# EAGLE design H0FR60 (EAGLE 9.3.0)

## Sheet 1 of 2
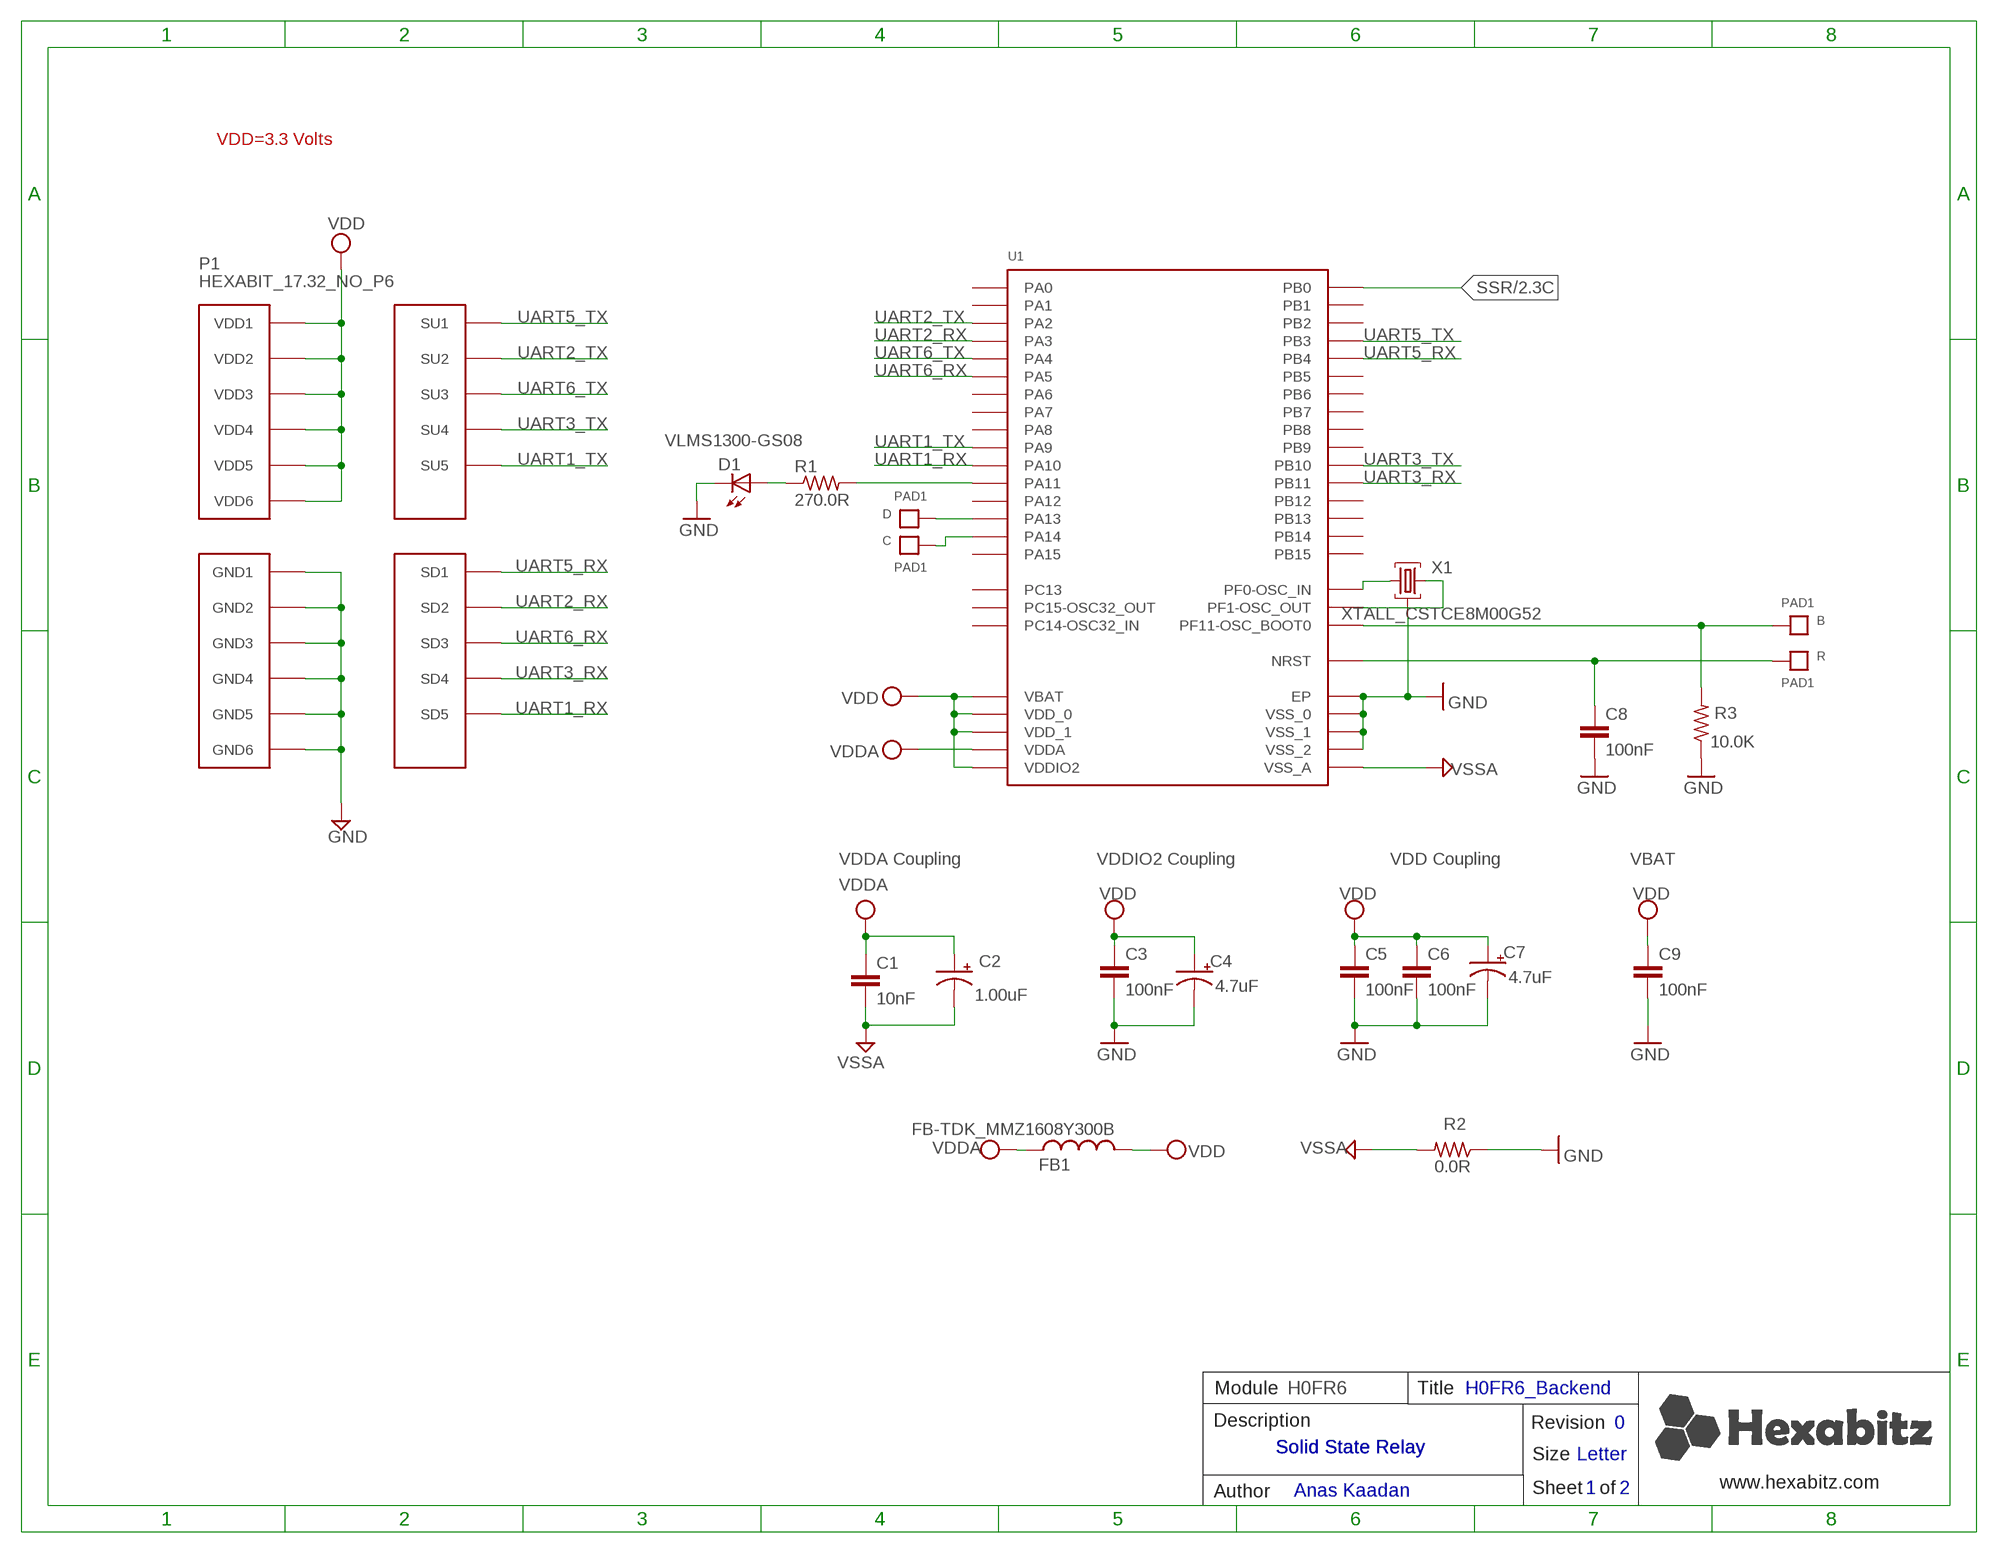
[diagram p0: schematic, sheet 1]

### Parts
B  PAD1  [PAD1]
C  PAD1  [PAD1]
C1  10nF  C-0603  [C-0603]
C2  1.00uF  C-0805-POL  [C-0805-POL]
C3  100nF  C-0603  [C-0603]
C4  4.7uF  C-0805-POL  [C-0805-POL]
C5  100nF  C-0603  [C-0603]
C6  100nF  C-0603  [C-0603]
C7  4.7uF  C-0805-POL  [C-0805-POL]
C8  100nF  C-0603  [C-0603]
C9  100nF  C-0603  [C-0603]
D  PAD1  [PAD1]
D1  VLMS1300-GS08  [VLMS1300-GS08]
FB1  FB-TDK_MMZ1608Y300B  [FB-TDK_MMZ1608Y300B]
P1  HEXABIT_17.32_NO_P6  [HEXABIT_17.32_NO_P6]
R  PAD1  [PAD1]
R1  270.0R  R-0603  [R-0603]
R2  0.0R  R-0603  [R-0603]
R3  10.0K  R-0603  [R-0603]
U1  STM32F091CBU6  [STM32F091CBU6]
X1  XTALL_CSTCE8M00G52  [XTALL_CSTCE8M00G52]

### Nets
B1: B.P$1 B.P$2 R3.2 U1.P$44(PF11-OSC_BOOT0)
GND: C3.2 C4.2(-) C5.2 C6.2 C7.2(-) C8.2 C9.2 D1.C P1.PAD_PD7(GND1) P1.PAD_PD8(GND2) P1.PAD_PD9(GND3) P1.PAD_PD10(GND4) P1.PAD_PD11(GND5) P1.PAD_PD12(GND6) R2.1 R3.1 U1.EP U1.P$23(VSS_0) U1.P$35(VSS_1) U1.P$47(VSS_2) X1.P$2 ; also sheet 2
N$1: D.P$1 D.P$2 U1.P$34(PA13)
N$2: C.P$1 C.P$2 U1.P$37(PA14)
N$3: R1.2 U1.P$32(PA11)
N$4: D1.A R1.1
N$5: U1.P$5(PF0-OSC_IN) X1.P$1
N$6: U1.P$6(PF1-OSC_OUT) X1.P$3
R1: C8.1 R.P$1 R.P$2 U1.P$7(NRST)
SSR: U1.P$18(PB0) ; also sheet 2
UART1_RX: P1.PAD_PD5(SD5) U1.P$31(PA10)
UART1_TX: P1.PAD_PU5(SU5) U1.P$30(PA9)
UART2_RX: P1.PAD_PD2(SD2) U1.P$13(PA3)
UART2_TX: P1.PAD_PU2(SU2) U1.P$12(PA2)
UART3_RX: P1.PAD_PD4(SD4) U1.P$22(PB11)
UART3_TX: P1.PAD_PU4(SU4) U1.P$21(PB10)
UART5_RX: P1.PAD_PD1(SD1) U1.P$40(PB4)
UART5_TX: P1.PAD_PU1(SU1) U1.P$39(PB3)
UART6_RX: P1.PAD_PD3(SD3) U1.P$15(PA5)
UART6_TX: P1.PAD_PU3(SU3) U1.P$14(PA4)
VDD: C3.1 C4.1(+) C5.1 C6.1 C7.1(+) C9.1 FB1.2 P1.PAD_PU7(VDD1) P1.PAD_PU8(VDD2) P1.PAD_PU9(VDD3) P1.PAD_PU10(VDD4) P1.PAD_PU11(VDD5) P1.PAD_PU12(VDD6) U1.P$1(VBAT) U1.P$24(VDD_0) U1.P$36(VDDIO2) U1.P$48(VDD_1) ; also sheet 2
VDDA: C1.1 C2.1(+) FB1.1 U1.P$9(VDDA)
VSSA: C1.2 C2.2(-) R2.2 U1.P$8(VSS_A)
Unconnected: U1.P$2(PC13) U1.P$3(PC14-OSC32_IN) U1.P$4(PC15-OSC32_OUT) U1.P$10(PA0) U1.P$11(PA1) U1.P$16(PA6) U1.P$17(PA7) U1.P$19(PB1) U1.P$20(PB2) U1.P$25(PB12) U1.P$26(PB13) U1.P$27(PB14) U1.P$28(PB15) U1.P$29(PA8) U1.P$33(PA12) U1.P$38(PA15) U1.P$41(PB5) U1.P$42(PB6) U1.P$43(PB7) U1.P$45(PB8) U1.P$46(PB9)

### Notes on the sheet
- VDD=3.3 Volts
- VDDA Coupling | VDDIO2 Coupling | VDD Coupling | VBAT
- Module | H0FR6 | Title | H0FR6_Backend
- Description | Revision | 0
- Solid State Relay | Solid State Relay
- Size | Letter
- www.hexabitz.com
- Author | Anas Kaadan | Sheet   of | 1 | 2
- C:/Users/Admin/Desktop/logodraft.bmp

## Sheet 2 of 2
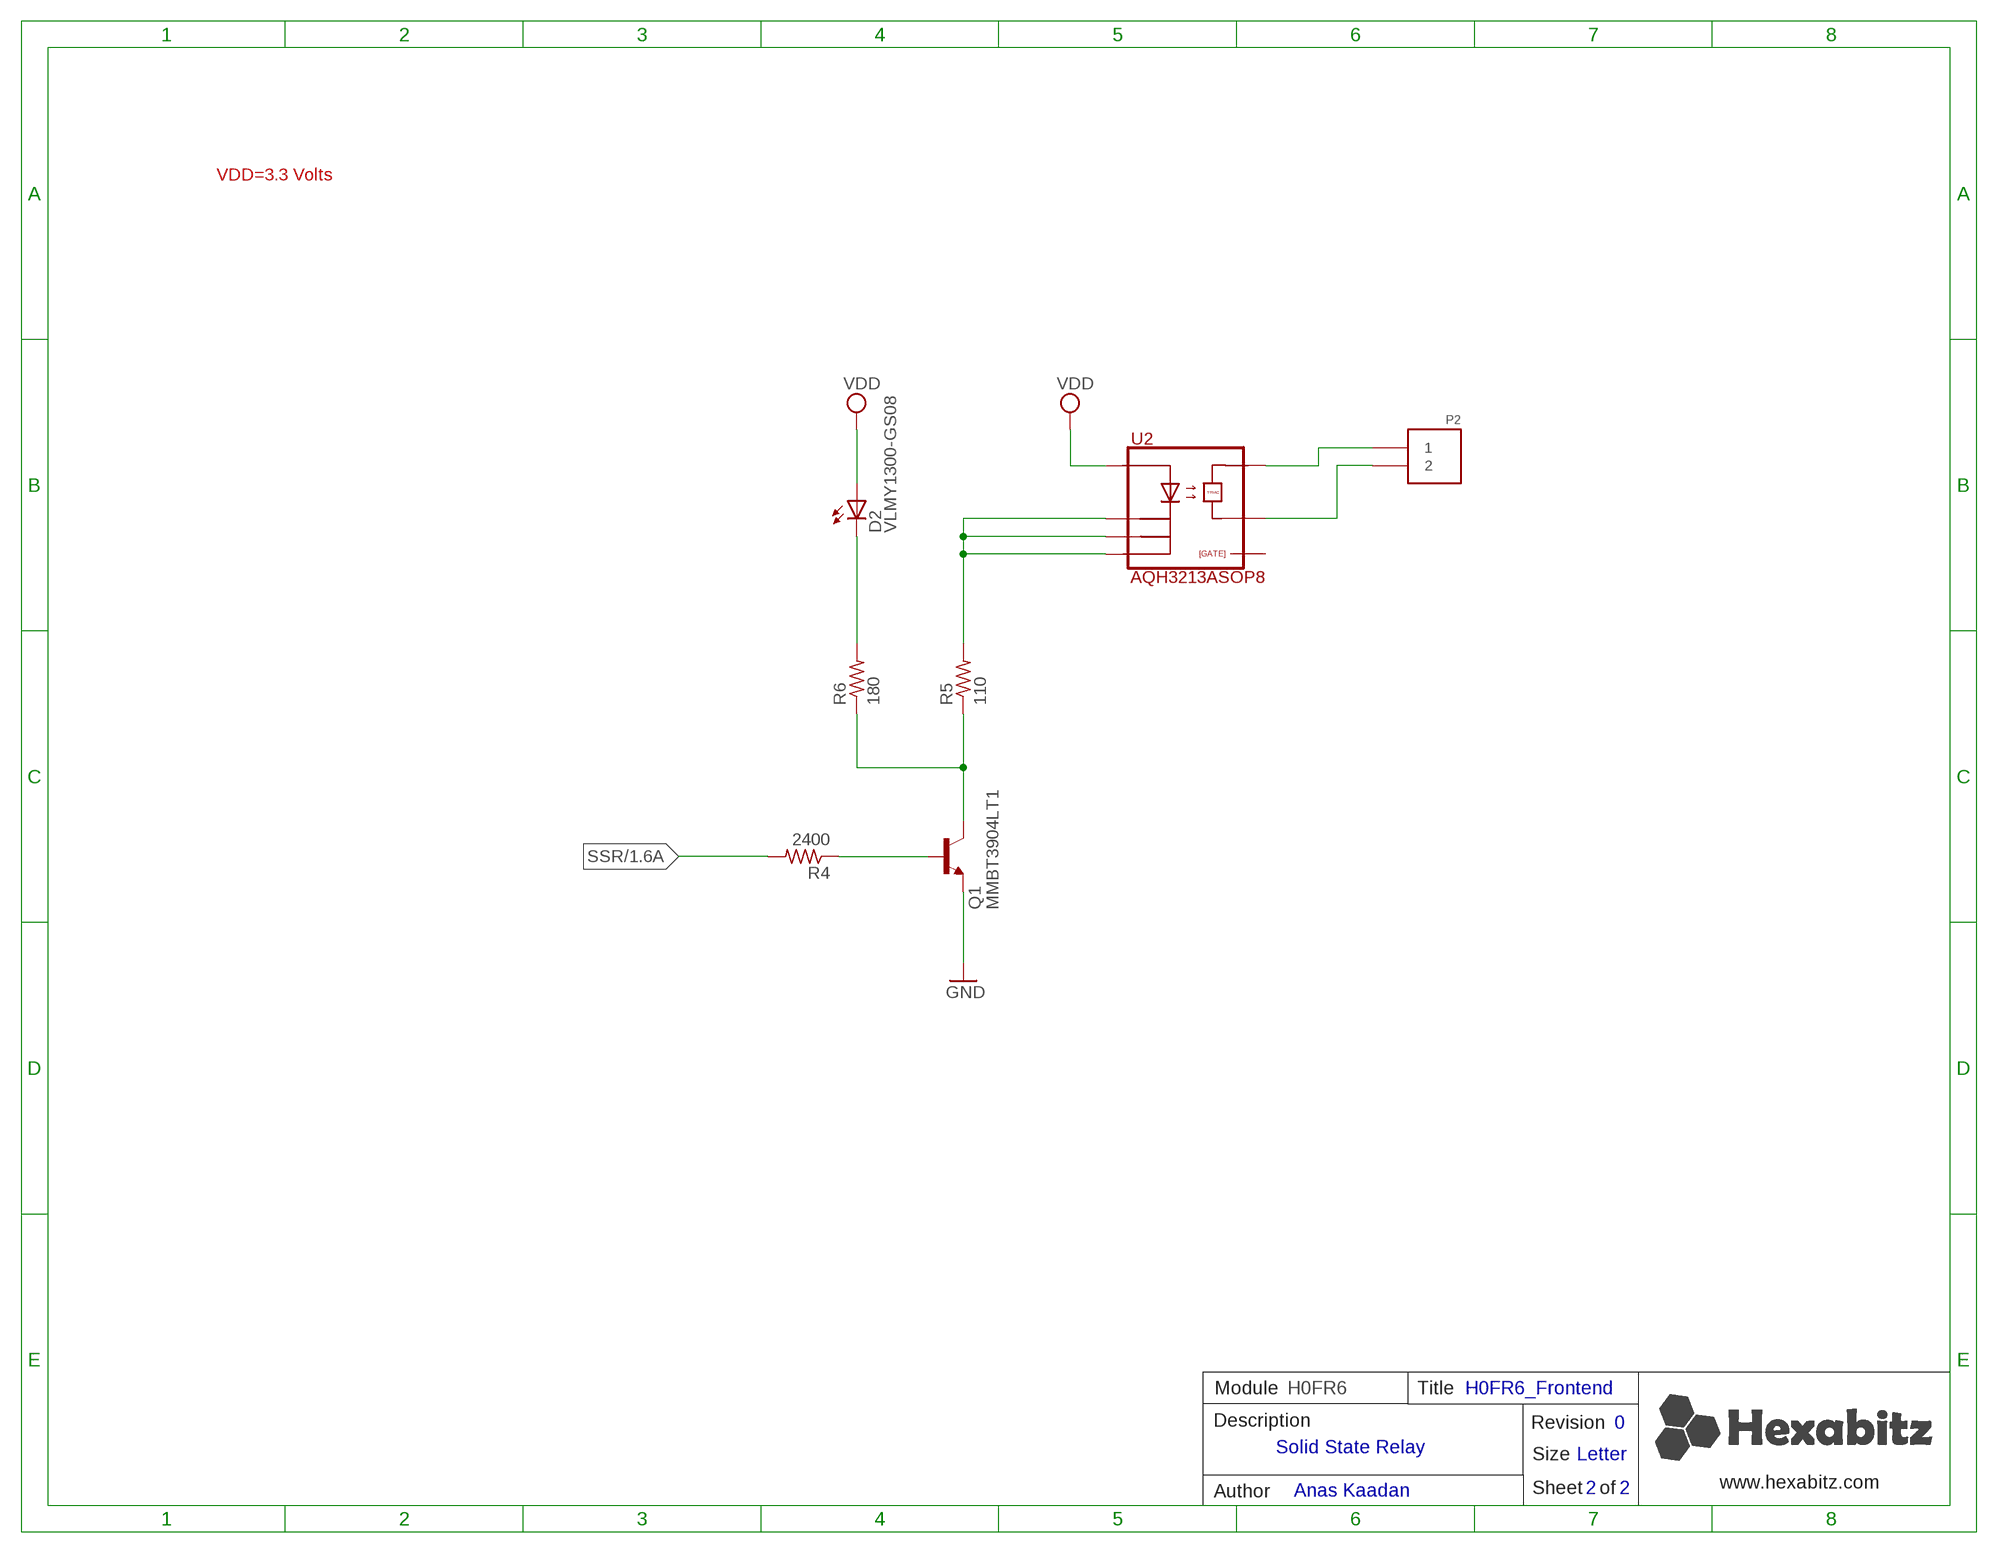
[diagram p1: schematic, sheet 2]

### Parts
D2  VLMY1300-GS08  VLMS1300-GS08  [VLMS1300-GS08]
P2  1546111-2  [1546111-2]
Q1  MMBT3904LT1  [MMBT3904LT1]
R4  2400  R-0603  [R-0603]
R5  110  R-0603  [R-0603]
R6  180  R-0603  [R-0603]
U2  AQH3213ASOP8  [AQH3213A]

### Nets
GND: Q1.2(E) ; also sheet 1
N$7: P2.1 U2.P$8
N$8: P2.2 U2.P$6
N$9: D2.C R6.2
N$10: R5.2 U2.P$1 U2.P$3 U2.P$4
N$11: Q1.3(C) R5.1 R6.1
N$13: Q1.1(B) R4.1
SSR: R4.2 ; also sheet 1
VDD: D2.A U2.P$2 ; also sheet 1
Unconnected: U2.P$5

### Notes on the sheet
- VDD=3.3 Volts
- Module | H0FR6 | Title | H0FR6_Frontend
- Description | Revision | 0
- Solid State Relay
- Size | Letter
- www.hexabitz.com
- Author | Anas Kaadan | Sheet   of | 2 | 2

## Library data of the parts
B C D R = Hexabitz:PAD1
C1 = Hexabitz:C-0603: CAP CER 10% X7R 0603; CAPACITANCE: 10nF; MFN: KEMET; MPN: C0603C103K5RACTU; OCTOPART_URL: https://octopart.com/c0603c103k5ractu-kemet-133094?r=sp&s=R_iPBxLnSmGqhkU2rIMFpg; TOLERANCE: 10%; VOLTAGE_RATING: 50V
C2 = Hexabitz:C-0805-POL: Cap Tant Solid SMD 2012; CAPACITANCE: 1.00uF; MFN: Yageo; MPN: CC0805KKX7R7BB105; OCTOPART_URL: https://octopart.com/cc0805kkx7r7bb105-yageo-8376555?r=sp&s=YKl1wwtkROau_X5nniH2ig; TOLERANCE: 10%; VOLTAGE_RATING: 16V
C3 C6 C8 = Hexabitz:C-0603: CAP CER 10% X7R 0603; CAPACITANCE: 100nF; MFN: KEMET; MPN: C0603C104K8RACTU; OCTOPART_URL: https://octopart.com/c0603c104k8ractu-kemet-145075?r=sp&s=9bS9ASSwSEqMCE9KBEQZ0g; TOLERANCE: 10%; VOLTAGE_RATING: 10V
C4 C7 = Hexabitz:C-0805-POL: Cap Tant Solid SMD 2012; CAPACITANCE: 4.7uF; MFN: Murata; MPN: GRM21BC81E475KA12L; OCTOPART_URL: https://octopart.com/grm21bc81e475ka12l-murata-10331911?r=sp&s=RY3qZSD8T6mG6TC9CHI5qQ; TOLERANCE: 10%; VOLTAGE_RATING: 25V
C5 = Hexabitz:C-0603: CAP CER 10% X7R 0603; CAPACITANCE: 100nF; MFN: KEMET; MPN: C0603C104K8RACTU; OCTOPART_URL: https://octopart.com/c0603c104k8ractu-kemet-145075?r=sp&s=9bS9ASSwSEqMCE9KBEQZ0g; TOLERANCE: 10%; VOLTAGE_RATING: 10
C9 = Hexabitz:C-0603: CAP CER 10% X7R 0603; CAPACITANCE: 100nF; MFN: KEMET; MPN: C0603C104K8RACTU; OCTOPART_URL: https://octopart.com/c0603c104k8ractu-kemet-145075?r=sp&s=9bS9ASSwSEqMCE9KBEQZ0g; TOLERANCE: 10V; VOLTAGE_RATING: 10%
D1 = Hexabitz:VLMS1300-GS08: Red 0603 130° Clear 54 mcd 2 V Surface Mount ChipLED ; Octopart Url : http://octopart.com/vlms1300-gs08-vishay-21709201; MFN: Vishay; MPN: VLMS1300-GS08; OCTOPART_URL: https://octopart.com/vlms1300-gs08-vishay-21709201?r=sp&s=_gcP4_q8T1SC6PJQPTQ9yA
D2 = Hexabitz:VLMS1300-GS08: Red 0603 130° Clear 54 mcd 2 V Surface Mount ChipLED ; Octopart Url : http://octopart.com/vlms1300-gs08-vishay-21709201; MFN: Vishay; MPN: VLMY1300-GS08; OCTOPART_URL: https://octopart.com/vlmy1300-gs08-vishay-21709204
FB1 = Hexabitz:FB-TDK_MMZ1608Y300B: Ferrite Beads Multi-Layer 30Ohm 25% 100MHz 1.5A 50mOhm DCR 0603; MFN: TDK; MPN: MMZ1608Y300B; OCTOPART_URL: https://octopart.com/mmz1608y300b-tdk-368280?r=sp&s=cd9_2ZEqQ9q9UNBuQgHAiA
P1 = hexabitz_connectors:HEXABIT_?_NO_P6: Hexabitz Hexagon Module Connector Hexagon side length = 17.32mm. The following ports are removed: P6
P2 = Hexabitz:1546111-2: EUROSTYLE TB,HEADER,GREY,2 POS; MFN: TE Connectivity; MPN: 1546111-2; OCTOPART_URL: https://octopart.com/1546111-2-te+connectivity-40393355
Q1 = Hexabitz:MMBT3904LT1: TRANS NPN 40V 0.2A SOT23; MFN: ON Semiconductor; MOUNTING_STYLE: Surface Mount; MPN: MMBT3904LT1G; NUM_OF_PINS: 3; OCTOPART_ID: 0bb6c2bc2200d471; OCTOPART_URL: http://octopart.com/mmbt3904lt1g-on+semiconductor-3280; PACKAGE: SOT-23-3; PACKAGING: Reel; POLARITY: NPN; POWER_DISSIPATION: 0.225 W; PRODUCT_CATEGORY: Transistors Bipolar-BJT; SERIES: MMBT3904L; VOLTAGE_RATING_DC: 40.0 V
R1 = Hexabitz:R-0603: Thick Film Resistors - SMD 0603; MFN: Yageo; MPN: RC0603FR-07270RL; OCTOPART_URL: https://octopart.com/search?q=RC0603FR-07270RL&start=0; RESISTANCE: 270.0 Ohm; TOLERANCE: 1%
R2 = Hexabitz:R-0603: Thick Film Resistors - SMD 0603; MFN: Yageo; MPN: RC0603JR-070RL; OCTOPART_URL: https://octopart.com/rc0603jr-070rl-yageo-1241539?r=sp&s=X2NteqRjRNWrnx42Y0aliA; RESISTANCE: 0.0 Ohm
R3 = Hexabitz:R-0603: Thick Film Resistors - SMD 0603; MFN: Yageo; MPN: RC0603JR-0710KL; OCTOPART_URL: https://octopart.com/search?q=RC0603JR-0710KL&start=0; RESISTANCE: 10.0K Ohm; TOLERANCE: 5%
R4 = Hexabitz:R-0603: Thick Film Resistors - SMD 0603; MFN: Yageo; MPN: RC0603JR-070RL; OCTOPART_URL: https://octopart.com/crcw06032k40jnea-vishay-40298967; RESISTANCE: 2400.0 Ω; TOLERANCE: ±5%
R5 = Hexabitz:R-0603: Thick Film Resistors - SMD 0603; MFN: Yageo; MPN: RC0402FR-07100RL; OCTOPART_URL: https://octopart.com/crcw0603110rfkea-vishay-39455532; RESISTANCE: 110.0 Ω; TOLERANCE: ±1%
R6 = Hexabitz:R-0603: Thick Film Resistors - SMD 0603; MFN: Yageo; MPN: RC0402FR-07100RL; OCTOPART_URL: https://octopart.com/erj-3geyj181v-panasonic-55403673; RESISTANCE: 180.0 Ω; TOLERANCE: ±5%
U1 = Hexabitz:STM32F091CBU6: Description : ARM-based 32-bit MCU, CAN, 12 timers, ADC, DAC & Comm. Interface, 2 to 3.6 V, -40 to 85 degC, 48-Pin UFQFPN, RoHS, Tray ;Parameter : Ciiva URL : https://ciiva.com/part/STM32F091CBU6-20240708, CiivaID : 20240708, Clock Speed : 48000000.0 Hz, Lifecycle Status : Active, Mounting Style : Surface Mount, Number of Pins : 48, Octopart Url : https://octopart.com/stm32f091cbu6-stmicroelectronics-51988677, OctopartID : 5f4f955c32ec8088, RAM Memory Size : 32768 B, REACH SVHC Compliance : No SVHC, RoHS : Compliant,; MFN: STMicroelectronics; MPN: STM32F091CBU6; OCTOPART_URL: https://octopart.com/stm32f091cbu6-stmicroelectronics-51988677?r=sp&s=bU6fpgsrTZOxHyt7jkfh3w
U2 = Hexabitz:AQH3213A: AH-H Series SPST 1.2 A 600 V Surface Mount Zero Cross State Relay - SMD-8; MFN: Panasonic; MPN: AQH3213A; OCTOPART_ID: 3c1df74ea8f7e3da; OCTOPART_URL: http://octopart.com/aqh3213a-panasonic-39432588; OUTPUT_CURRENT: 1.2 A; OUTPUT_VOLTAGE: 600.0 V
X1 = Hexabitz:XTALL_CSTCE8M00G52: MURATA CSTCE8M00G52-R0 RESONATOR, SMD, 8MHZ ; Octopart Url : https://octopart.com/cstce8m00g52-r0-murata-7145559; MFN: Murata; MPN: CSTCE8M00G52Z-R0; OCTOPART_URL: https://octopart.com/cstce8m00g52z-r0-murata-17755941?r=sp&s=JDnNJnrHQhyS8Zk4ofFWXw

## Board
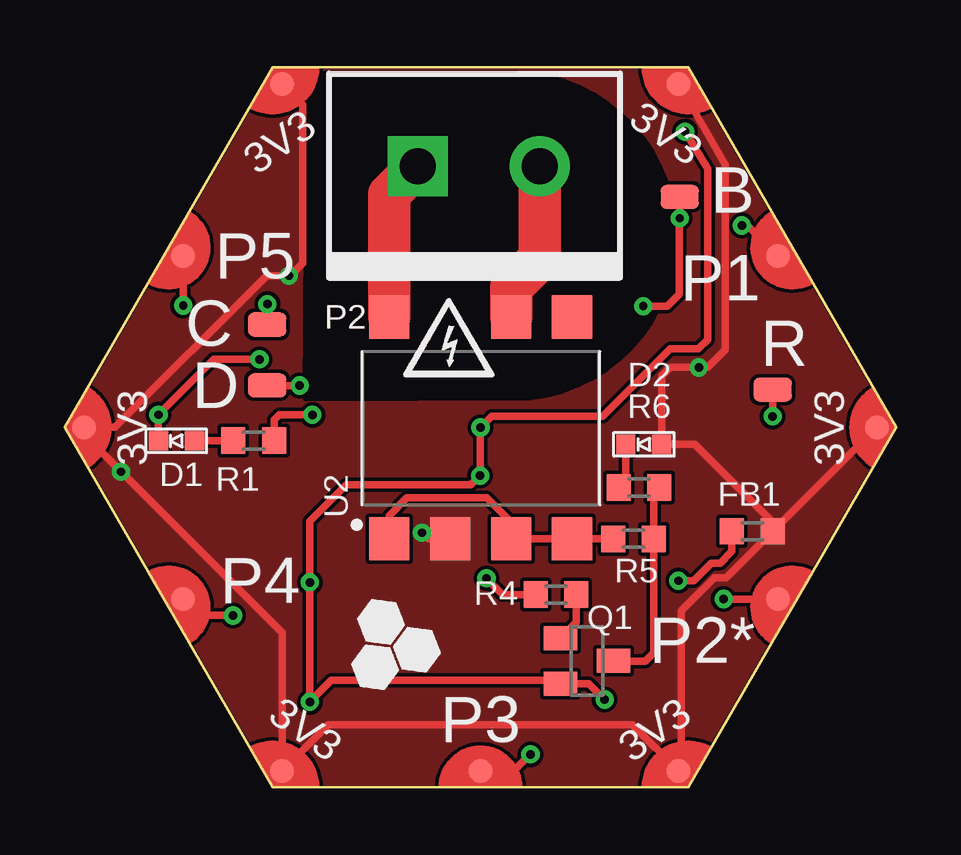
[diagram p2: board, top side]
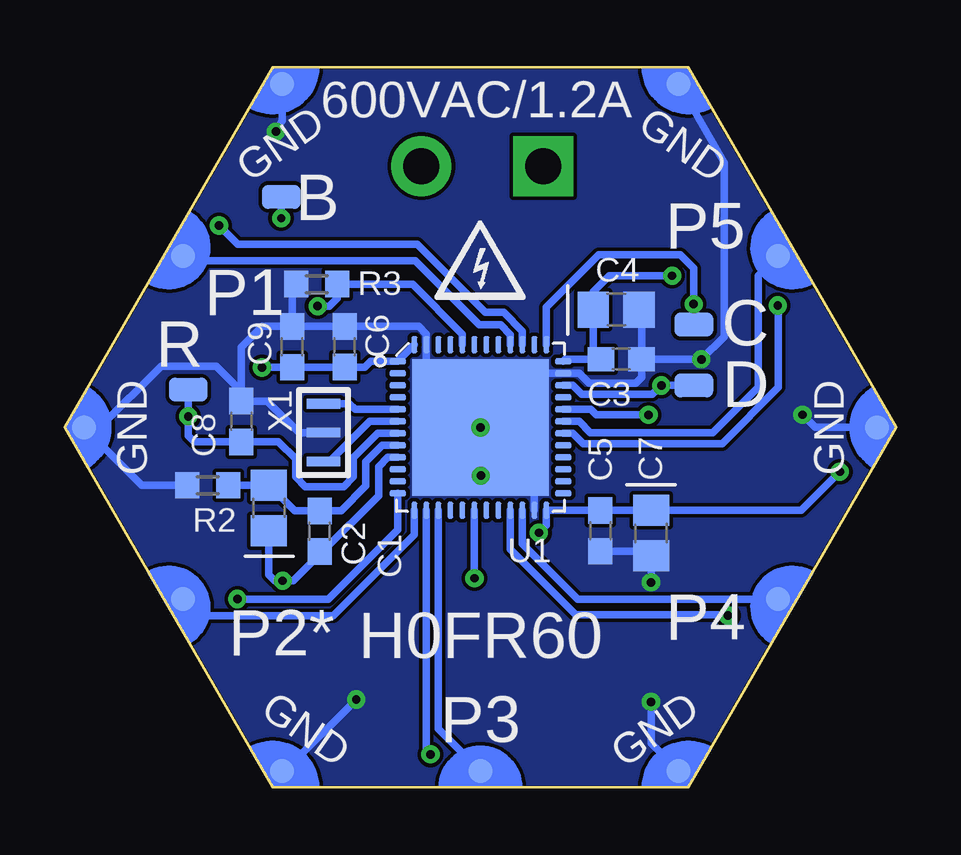
[diagram p3: board, bottom side, seen from below]

Size 34.64 x 30 mm. Coordinates in mm from the lower left corner, seen from the top.
Copper layers (1*16): Top 0.035mm / dielectric 1.5mm / Bottom 0.035mm
Design rules "2_layer *": minimum track width 7mil, minimum drill 10mil, track to track 6mil, track to pad 6mil, pad to pad 6mil, via to via 6mil, smd to smd 0mil, copper to edge 1mil, drill to drill 8mil, minimum pad ring 10mil, minimum via ring 8mil, stop-mask expansion 2mil, vias tented up to drill 15mil, thermal gap 10mil

### Footprints (pad centres in the part's own frame; a part is rotated, then mirrored left to right if it is on the bottom)
PAD1 = smd 1.6 x 1: P$1 0,0 | smd 1.6 x 1 bottom: P$2 0,0
C-0603 = smd 1.1 x 1: 1 -0.85,0; 2 0.85,0
C-0805-POL = smd 1.3 x 1.5: 1 -0.95,0; 2 0.95,0
VLMS1300-GS08 = smd 0.8 x 0.8: A 0,0.75; C 0,-0.75
FB-TDK_MMZ1608Y300B = smd 1 x 1.1: 1 -0.85,0; 2 0.85,0
HEXABIT_17.32_NO_P6 = smd 1 x 1 bottom: PAD_PD1 12.39,7.15; PAD_PD2 12.39,-7.15; PAD_PD3 0,-14.31; PAD_PD4 -12.39,-7.15; PAD_PD5 -12.39,7.15; PAD_PD7 8.26,14.31; PAD_PD8 16.52,0; PAD_PD9 8.26,-14.31; PAD_PD10 -8.26,-14.31; PAD_PD11 -16.52,0; PAD_PD12 -8.26,14.31 | smd 1 x 1: PAD_PU1 12.39,7.15; PAD_PU2 12.39,-7.15; PAD_PU3 0,-14.31; PAD_PU4 -12.39,-7.15; PAD_PU5 -12.39,7.15; PAD_PU7 8.26,14.31; PAD_PU8 16.52,0; PAD_PU9 8.26,-14.31; PAD_PU10 -8.26,-14.31; PAD_PU11 -16.52,0; PAD_PU12 -8.26,14.31
1546111-2 = drill 1.5 pad 2.5 square: 1 -2.54,0 | drill 1.5 pad 2.5: 2 2.54,0
MMBT3904LT1 = smd 1 x 1.4: 1 -0.95,-1.1; 2 0.95,-1.1; 3 0,1.1
R-0603 = smd 1 x 1.1: 1 -0.85,0; 2 0.85,0
STM32F091CBU6 = smd 5.7 x 5.7: EP 0,0 | smd 0.25 x 0.7: P$1 -2.75,-3.45; P$2 -2.25,-3.45; P$3 -1.75,-3.45; P$4 -1.25,-3.45; P$5 -0.75,-3.45; P$6 -0.25,-3.45; P$7 0.25,-3.45; P$8 0.75,-3.45; P$9 1.25,-3.45; P$10 1.75,-3.45; P$11 2.25,-3.45; P$12 2.75,-3.45; P$25 2.75,3.45; P$26 2.25,3.45; P$27 1.75,3.45; P$28 1.25,3.45; P$29 0.75,3.45; P$30 0.25,3.45; P$31 -0.25,3.45; P$32 -0.75,3.45; P$33 -1.25,3.45; P$34 -1.75,3.45; P$35 -2.25,3.45; P$36 -2.75,3.45 | smd 0.7 x 0.25: P$13 3.45,-2.75; P$14 3.45,-2.25; P$15 3.45,-1.75; P$16 3.45,-1.25; P$17 3.45,-0.75; P$18 3.45,-0.25; P$19 3.45,0.25; P$20 3.45,0.75; P$21 3.45,1.25; P$22 3.45,1.75; P$23 3.45,2.25; P$24 3.45,2.75; P$37 -3.45,2.75; P$38 -3.45,2.25; P$39 -3.45,1.75; P$40 -3.45,1.25; P$41 -3.45,0.75; P$42 -3.45,0.25; P$43 -3.45,-0.25; P$44 -3.45,-0.75; P$45 -3.45,-1.25; P$46 -3.45,-1.75; P$47 -3.45,-2.25; P$48 -3.45,-2.75
AQH3213A = smd 1.812 x 1.672: P$1 -4.62,3.81; P$2 -4.62,1.27; P$3 -4.62,-1.27; P$4 -4.62,-3.81; P$5 4.62,-3.81; P$6 4.62,-1.27; P$8 4.62,3.81
XTALL_CSTCE8M00G52 = smd 1.4 x 0.4: P$1 0,1.2; P$2 0,0; P$3 0,-1.2

### Placement (x,y rotation side)
B  25.62,24.6 0 top
C  8.43,19.29 0 top
C1  24.02,10.67 90 bottom
C2  26.13,11.64 90 bottom
C3  11.46,17.84 0 bottom
C4  11.67,19.91 0 bottom
C5  12.32,10.69 270 bottom
C6  22.98,18.36 90 bottom
C7  10.21,10.6 270 bottom
C8  27.28,15.25 90 bottom
C9  25.16,18.36 90 bottom
D  8.43,16.75 180 top
D1  4.65,14.44 270 top
D2  24.13,14.29 270 top
FB1  28.65,10.68 0 top
P1  17.32,15 0 top
P2  17.24,25.89 0 top
Q1  21.76,5.27 270 top
R  29.5,16.57 0 top
R1  7.88,14.45 0 top
R2  28.68,12.59 0 bottom
R3  24.14,20.97 0 bottom
R4  20.47,8.04 180 top
R5  23.69,10.36 180 top
R6  23.93,12.5 180 top
U1  17.32,15 270 bottom
U2  17.33,14.98 90 top
X1  23.86,14.78 0 bottom

### Tracks (layer width: path | path; a pad name or v marks a point on that pad's centre or on a via)
B1  (via drill 0.35)
  Top 0.305: B.P$1 v25.62,23.72 | v25.62,23.72 | v25.62,23.72 25.6,23.7 25.6,20.55 25.11,20.05 v24.1,20.05
  Bottom 0.305: U1.P$44 18.07,18.89 20.15,20.97 R3.2 | v25.62,23.72 B.P$1 | R3.2 | v24.1,20.05 23.62,20.05 23.29,20.39 R3.2
GND  (via drill 0.35)
  Top 0.305: v10.21,3.56 v10.21,3.57 | v10.21,3.57 11.1,4.46 20.52,4.46 Q1.2 21.84,4.32 v22.49,3.66 | v25.84,27.32 26.78,25.78 26.78,18.66 26.4,18.28 25.23,18.28 22.41,15.46 17.78,15.46 U1.EP 17.32,13.01 v17.3,12.99 16.92,12.61 11.72,12.61 10.21,11.1 v10.21,8.54 v10.21,3.57 | v8.11,17.84 6.21,17.84 v3.9,15.53 D1.C
  Bottom 0.178: 15.09,17.25 15.09,17.23
  Bottom 0.305: P1.PAD_PD12 7.17,26.03 7.17,18.78 v8.11,17.84 C3.2 | U1.P$23 15.07,12.55 15.51,12.99 v17.3,12.99 | C9.2 26.41,19.21 27.28,18.34 C8.2 | R2.1 31.43,12.59 P1.PAD_PD8 33.18,15 30.63,17.55 28.32,17.55 27.28,16.5 C8.2 | C4.2 10.61,19.8 C3.2 | 15.09,17.25 U1.P$35 13.2,17.25 12.78,16.83 10.86,16.83 10.61,17.09 C3.2 | v10.21,3.56 10.21,1.84 P1.PAD_PD10 | C9.2 C6.2 19.9,19.21 19.57,18.89 U1.P$47 19.57,17.25 U1.EP 15.09,17.23 | X1.P$2 24.88,14.78 26.2,16.1 C8.2 | R3.1 25.16,20.8 C9.2 | P1.PAD_PD7 25.58,27.77 25.59,27.76 v25.84,27.32 | v22.49,3.66 25.47,0.69 P1.PAD_PD9 | v3.9,15.53 3.37,15 P1.PAD_PD11 | C5.2 10.4,9.84 C7.2 v10.21,8.55 v10.21,8.54
  other vias: 17.32,15
  pour Bottom (no thermals): 8.66,0 25.98,0 34.64,15 25.98,30 8.66,30 0,15
KEEPOUT
  cutout Top: 10.14,29.72 18.79,29.72 arc-172 19.38,16.27 10.05,16.23
N$1  (via drill 0.35)
  Top 0.305: v9.78,16.75 D.P$2
  Bottom 0.305: U1.P$34 13.47,16.75 13.1,16.38 10.15,16.38 v9.78,16.75 | v9.78,16.75 | D.P$2 v9.78,16.75
N$2  (via drill 0.35)
  Top 0.305: C.P$2 8.43,20.12 v8.44,20.14
  Bottom 0.305: U1.P$37 14.57,20.02 12.39,22.2 8.99,22.2 8.44,21.64 v8.44,20.14 C.P$2
N$3  (via drill 0.35)
  Top 0.305: R1.2 8.73,15.32 8.93,15.52 v10.32,15.52
  Bottom 0.305: U1.P$32 12.72,15.75 12.51,15.53 10.32,15.53 v10.32,15.52
N$4
  Top 0.305: D1.A R1.1
N$5
  Bottom 0.305: X1.P$1 22.78,15.99 22.54,15.75 U1.P$5
N$6
  Bottom 0.305: U1.P$6 21.94,15.25 23.6,13.58 X1.P$3
N$7
  Top 1.778: U2.P$8 13.52,24.71 P2.1
N$8
  Top 1.778: U2.P$6 18.6,20.84 19.78,22.02 P2.2
N$9
  Top 0.305: D2.C 23.38,12.8 R6.2
N$10
  Top 0.305: U2.P$1 13.52,11.32 14.26,12.06 17.59,12.06 18.6,11.05 U2.P$3 U2.P$4 R5.2
N$11
  Top 0.305: R6.1 24.54,12.26 R5.1 24.54,5.62 24.18,5.26 22.87,5.26 Q1.3
N$13
  Top 0.305: Q1.1 21.32,6.88 R4.1
R1  (via drill 0.35)
  Top 0.305: R.P$1 v29.49,15.46
  Bottom 0.305: R.P$1 v29.49,15.46 29.49,14.66 29.5,14.65 29.25,14.4 C8.1 25.74,14.4 25.02,13.68 25.02,12.94 24.62,12.53 23.02,12.53 22.62,12.94 22.62,13.73 21.6,14.75 U1.P$7
SSR  (via drill 0.35)
  Top 0.305: R4.2 18.25,8.04 v17.57,8.72
  Bottom 0.305: U1.P$18 v17.57,8.72
UART1_RX
  Bottom 0.305: P1.PAD_PD5 5.75,21.33 5.75,16.68 7.65,14.79 12.75,14.79 13.21,15.25 U1.P$31
UART1_TX  (via drill 0.35)
  Top 0.305: v4.93,20.08 P1.PAD_PU5
  Bottom 0.305: v4.93,20.08 4.91,20.05 4.91,16.66 7.25,14.33 13.04,14.33 13.47,14.75 U1.P$30
UART2_RX
  Bottom 0.305: U1.P$13 20.07,10.54 23.45,7.16 29.02,7.16 P1.PAD_PD2
UART2_TX  (via drill 0.35)
  Top 0.305: v27.45,7.85 P1.PAD_PU2
  Bottom 0.305: U1.P$12 20.77,10.73 23.66,7.84 v27.44,7.84 v27.45,7.85
UART3_RX
  Bottom 0.305: U1.P$22 15.57,10.16 13.26,7.85 P1.PAD_PD4
UART3_TX  (via drill 0.35)
  Top 0.305: v7.01,7.16 5.61,7.16 P1.PAD_PU4
  Bottom 0.305: v7.01,7.16 7.01,7.2 13.34,7.2 16.07,9.93 U1.P$21
UART5_RX
  Bottom 0.305: U1.P$40 16.07,18.86 16.48,19.27 17.38,19.27 20.04,21.94 26.55,21.94 29.5,21.94 P1.PAD_PD1
UART5_TX  (via drill 0.35)
  Top 0.305: v28.21,23.41 28.45,23.41 P1.PAD_PU1
  Bottom 0.305: U1.P$39 15.57,19.02 16.36,19.8 17.13,19.8 19.95,22.62 27.42,22.62 v28.21,23.41
UART6_RX
  Bottom 0.305: U1.P$15 19.07,11.44 19.07,7.67 19.07,7.39 19.07,7.37 19.07,2.44 P1.PAD_PD3
UART6_TX  (via drill 0.35)
  Top 0.305: v19.4,1.38 18.72,0.69 P1.PAD_PU3
  Bottom 0.305: U1.P$14 19.57,1.54 v19.4,1.38 | v19.4,1.38
VDD  (via drill 0.35)
  Top 0.305: v14.89,10.61 15.14,10.36 U2.P$2 | P1.PAD_PU7 27.53,25.94 27.53,18.23 26.79,17.5 v26.42,17.5 25.22,17.5 24.88,17.16 D2.A 26.25,14.29 29.5,11.04 FB1.2 | P1.PAD_PU12 9.91,28.45 9.91,21.85 9.39,21.32 v9.33,21.32 8.41,21.32 2.09,15 P1.PAD_PU11 0.8,14.7 v2.34,13.15 9.06,6.44 P1.PAD_PU10 10.98,2.62 23.65,2.62 P1.PAD_PU9 25.69,0.8 25.69,7.37 27.07,8.75 27.57,8.75 FB1.2 | FB1.2 33.82,15 P1.PAD_PU8
  Bottom 0.305: U1.P$48 U1.P$1 21.9,17.75 22.14,17.51 C6.1 C9.1 25.17,17.5 v26.42,17.5 | v2.34,13.15 3.95,11.55 C7.1 C5.1 U1.P$24 14.57,10.93 v14.89,10.61 | U1.P$36 13.78,17.84 C3.1 12.61,18.15 C4.1 12.61,20.66 11.96,21.32 v9.34,21.32 v9.33,21.32
  pour Top (no thermals): 8.66,0 25.98,0 34.64,15 25.98,30 8.66,30 0,15
VDDA  (via drill 0.35)
  Top 0.305: FB1.1 27.8,9.83 27.32,9.35 26.94,9.35 26.2,8.61 v25.56,8.61
  Bottom 0.305: U1.P$9 21.18,13.75 21.56,13.36 21.56,12.16 23.9,9.82 | 23.9,9.82 C1.1 | 23.9,9.82 25.11,8.61 v25.56,8.61 25.88,8.61 26.13,8.86 C2.1
VSSA
  Bottom 0.305: U1.P$8 21.41,14.25 22.09,13.57 22.09,12.56 23.12,11.53 C1.2 25.06,11.52 C2.2 R2.2

### Text on the board
tPlace: 3V3 | 3V3 | P5 | P1 | 3V3 | 3V3 | P4 | P2* | 3V3 | P3 | 3V3
bPlace: 600VAC/1.2A | GND | GND | P5 | P1 | GND | GND | P4 | H0FR60 | P2* | GND | P3 | GND
bNames: B | R | C | D